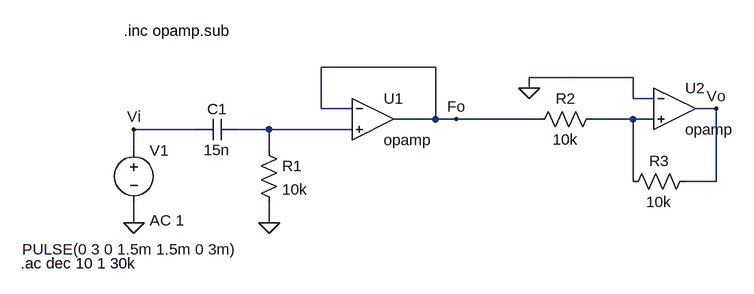
[diagram p0: schematic Gain Stage.asc]
Gain Stage.asc, the LTspice schematic file:
Version 4
SHEET 1 880 680
WIRE 400 16 224 16
WIRE 704 32 544 32
WIRE 544 48 544 32
WIRE 704 64 704 32
WIRE 736 64 704 64
WIRE 224 80 224 16
WIRE 272 80 224 80
WIRE 832 80 800 80
WIRE 400 96 400 16
WIRE 400 96 336 96
WIRE 432 96 400 96
WIRE 560 96 432 96
WIRE 704 96 640 96
WIRE 736 96 704 96
WIRE 32 112 -64 112
WIRE 144 112 96 112
WIRE 272 112 144 112
WIRE -64 144 -64 112
WIRE 144 144 144 112
WIRE 704 192 704 96
WIRE 832 192 832 80
WIRE 832 192 784 192
WIRE -64 256 -64 224
WIRE 144 256 144 224
FLAG 144 256 0
FLAG -64 256 0
FLAG 544 48 0
FLAG 832 80 Vo
FLAG 432 96 Fo
FLAG -64 112 Vi
SYMBOL voltage -64 128 R0
WINDOW 3 -172 169 Left 2
WINDOW 123 24 124 Left 2
WINDOW 39 0 0 Left 0
SYMATTR InstName V1
SYMATTR Value PULSE(0 3 0 1.5m 1.5m 0 3m)
SYMATTR Value2 AC 1
SYMBOL OpAmps\\opamp 304 32 R0
SYMATTR InstName U1
SYMBOL res 128 128 R0
SYMATTR InstName R1
SYMATTR Value 10k
SYMBOL cap 96 96 R90
WINDOW 0 0 32 VBottom 2
WINDOW 3 32 32 VTop 2
SYMATTR InstName C1
SYMATTR Value 15n
SYMBOL res 656 80 R90
WINDOW 0 0 56 VBottom 2
WINDOW 3 32 56 VTop 2
SYMATTR InstName R2
SYMATTR Value 10k
SYMBOL OpAmps\\opamp 768 16 R0
SYMATTR InstName U2
SYMBOL res 800 176 R90
WINDOW 0 0 56 VBottom 2
WINDOW 3 32 56 VTop 2
SYMATTR InstName R3
SYMATTR Value 10k
TEXT -80 -40 Left 2 !.inc opamp.sub
TEXT -238 318 Left 2 !.ac dec 10 1 30k

The netlist it stands for:
* Gain Stage.asc
V1 Vi 0 PULSE(0 3 0 1.5m 1.5m 0 3m) AC 1
XU1 Fo N002 Fo opamp Aol=100K GBW=10Meg  ; pins invin noninvin out
R1 N002 0 10k
C1 N002 Vi 15n
R2 N001 Fo 10k
XU2 0 N001 Vo opamp Aol=100K GBW=10Meg  ; pins invin noninvin out
R3 Vo N001 10k
.inc opamp.sub
.ac dec 10 1 30k
.backanno
.end